# EAGLE design LM22674-5.0 (EAGLE 9.2.2)
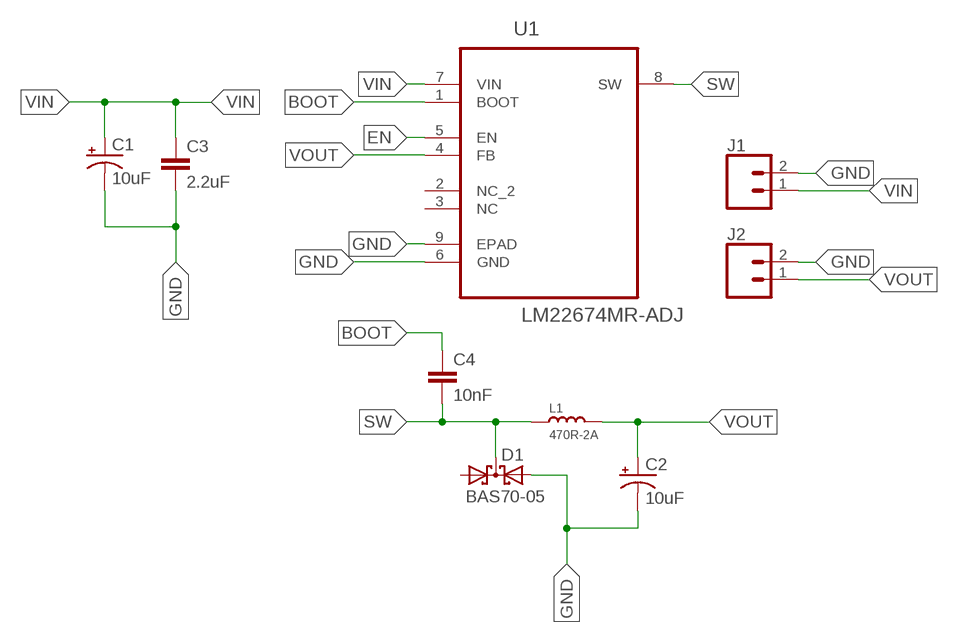
[diagram p0: schematic, sheet 1]

## Parts
C1  10uF  10UF-POLAR-EIA3216-16V-10%(TANT)  [EIA3216]
C2  10uF  10UF-POLAR-EIA3216-16V-10%(TANT)  [EIA3216]
C3  2.2uF  2.2UF-0603-10V-20%  [0603]
C4  10nF  10NF-0603-50V-10%  [0603]
D1  BAS70-05  [SOT23]
J1  CONN_02PTH4  [1X02_XTRA_BIG]
J2  CONN_02PTH4  [1X02_XTRA_BIG]
L1  470R-2A  SMD-FERRITE-BEAD-470R-2A(0805)'0805'  [L0805]
U1  LM22674MR-ADJ  [SOIC127P600X168-9N]

## Nets
BOOT: C4.1 U1.1(BOOT)
EN: U1.5(EN)
GND: C1.- C2.- C3.2 D1.2(A2) J1.2 J2.2 U1.6(GND) U1.9(EPAD)
SW: C4.2 D1.3(C) L1.1 U1.8(SW)
VIN: C1.+ C3.1 J1.1 U1.7(VIN)
VOUT: C2.+ J2.1 L1.2 U1.4(FB)
Unconnected: D1.1(A1) U1.2(NC_2) U1.3(NC)

## Library data of the parts
C1 C2 = SparkFun-Capacitors:10UF-POLAR: 10.0µF polarized capacitors A capacitor is a passive two-terminal electrical component used to store electrical energy temporarily in an electric field.; PROD_ID: CAP-00811
C3 = SparkFun-Capacitors:2.2UF: 2.2µF ceramic capacitors A capacitor is a passive two-terminal electrical component used to store electrical energy temporarily in an electric field.; PROD_ID: CAP-07888
C4 = SparkFun-Capacitors:10NF: 0.01uF/10nF/10,000pF ceramic capacitors A capacitor is a passive two-terminal electrical component used to store electrical energy temporarily in an electric field. CAP-09321; PROD_ID: CAP-00867
D1 = diode:BAS70-05: Silicon Schottky Diodes General-purpose diode for high-speed switching
J1 J2 = SparkFun-Connectors:CONN_02: Multi connection point. Often used as Generic Header-pin footprint for 0.1 inch spaced/style header connections On any of the 0.1 inch spaced packages, you can populate with these: Break Away Headers - Straight <https://www.sparkfun.com/products/116> (PRT-00116) Break Away Male Headers - Right Angle <https://www.sparkfun.com/products/553> (PRT-00553) Female Headers <https://www.sparkfun.com/products/115> (PRT-00115) Break Away Headers - Machine Pin <https://www.sparkfun.com/products/117> (PRT-00117) Break Away Female Headers - Swiss Machine Pin <https://www.sparkfun.com/products/743> (PRT-00743) For SCREWTERMINALS and SPRING TERMINALS visit here: Screw Terimnals on SparkFun.com <https://www.sparkfun.com/search/results?term=Screw+Terminals> (5mm/3.5mm/2.54mm spacing) This device is also useful as a general connection point to wire up your design to another part of your project. Our various solder wires solder well into these plated through hole pads. Hook-Up Wire - Assortment (Stranded, 22 AWG) <https://www.sparkfun.com/products/11375> (PRT-11375) Hook-Up Wire - Assortment (Solid Core, 22 AWG) <https://www.sparkfun.com/products/11367> (PRT-11367) View the entire wire category on our website here <https://www.sparkfun.com/categories/141> Special notes: Molex polarized connector foot print use with: PRT-08233 with associated crimp pins and housings. 2.54_SCREWTERM for use with PRT-10571. 3.5mm Screw Terminal footprints for PRT-08084 5mm Screw Terminal footprints for use with PRT-08432
L1 = Seeed-Inductor:SMD-FERRITE-BEAD-470R-2A(0805): 303030008; MPN: WLB2012-471T20
U1 = LM22674MR-ADJ:LM22674MR-ADJ: Step-Down Voltage Regulator; AVAILABILITY: Unavailable; DESCRIPTION: REGULATOR, ADJ. VOLTAGE, 0.5A 8PSOP; Primary Input Voltage: 42V; No. of Outputs: 1; Output Current: 500mA; Voltage Re...; MF: Texas Instruments; MP: LM22674MR-ADJ; PACKAGE: None; PRICE: None

## Board
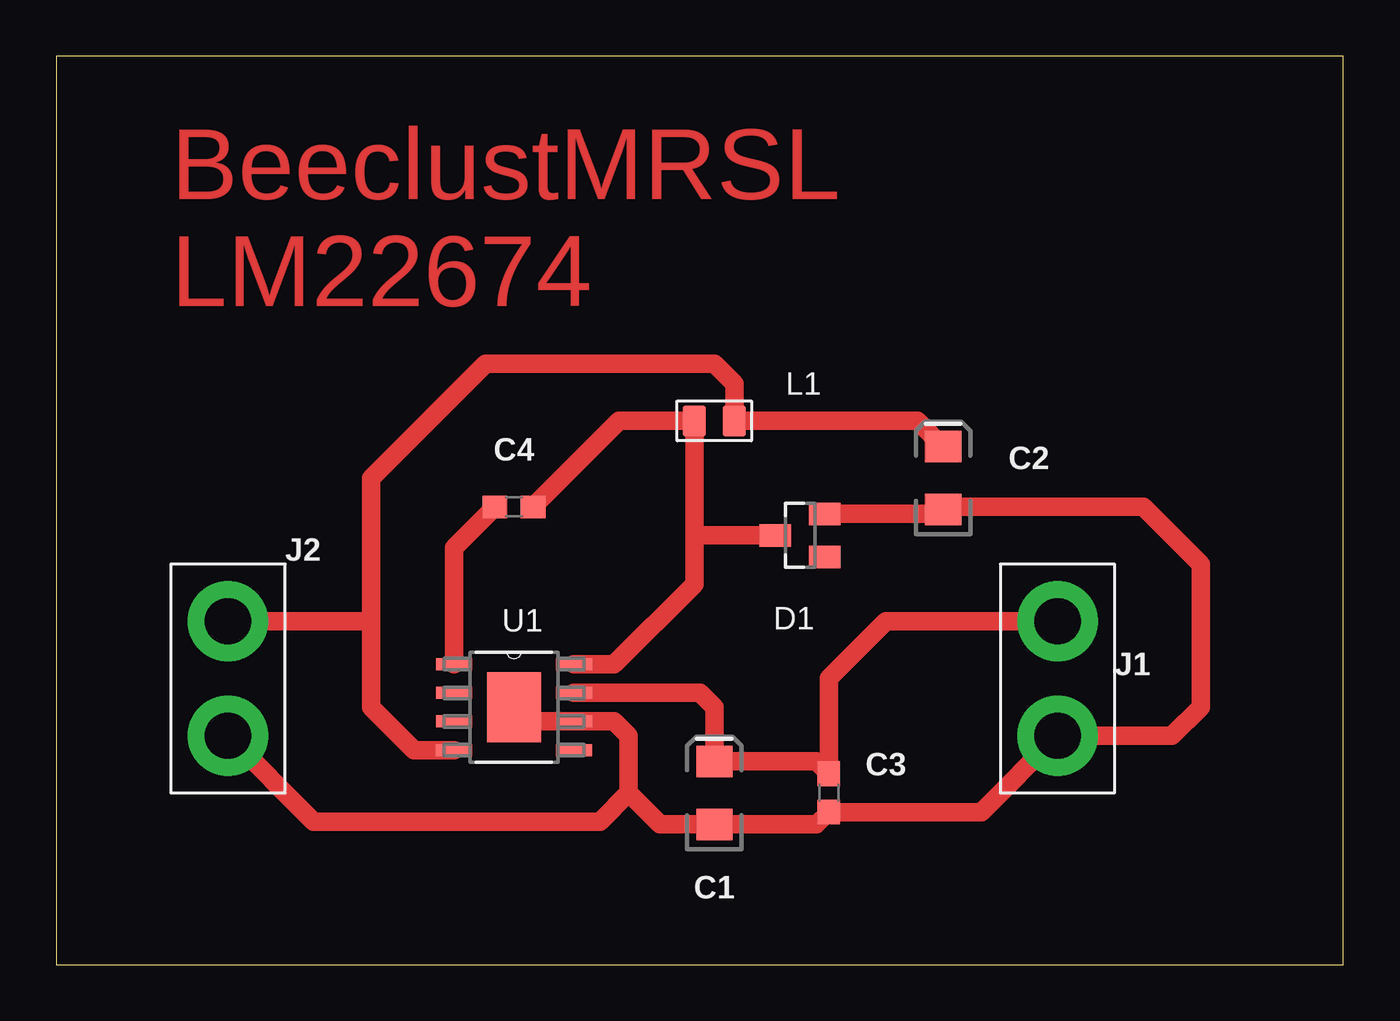
[diagram p1: board, top side]

Size 57.13 x 40.31 mm. Coordinates in mm from the lower left corner, seen from the top.
Outline: 0,0 57.13,0 57.13,40.31 0,40.31 0,0
Copper layers (1*16): Top 0.035mm / dielectric 1.5mm / Bottom 0.035mm
Design rules "default": minimum track width 6mil, minimum drill 0.35mm, track to track 6mil, track to pad 6mil, pad to pad 6mil, via to via 6mil, smd to smd 6mil, copper to edge 40mil, drill to drill 6mil, minimum pad ring 10mil, minimum via ring 8mil, stop-mask expansion 4mil, vias tented up to drill 0mil, thermal gap 10mil

### Footprints (pad centres in the part's own frame; a part is rotated, then mirrored left to right if it is on the bottom)
EIA3216 = smd 1.4 x 1.6: + 1.4,0; - -1.4,0
0603 = smd 1.1 x 1: 1 -0.85,0; 2 0.85,0
SOT23 = smd 1 x 1.4: 1 -0.95,-1.1; 2 0.95,-1.1; 3 0,1.1
1X02_XTRA_BIG = drill 2.057 pad 3.556: 1 -2.54,0; 2 2.54,0
L0805 = smd 1.016 x 1.397: 1 -0.889,0; 2 0.889,0
SOIC127P600X168-9N = smd 1.6 x 0.533: 1 -2.667,1.905; 2 -2.667,0.635; 3 -2.667,-0.635; 4 -2.667,-1.905; 5 2.667,-1.905; 6 2.667,-0.635; 7 2.667,0.635; 8 2.667,1.905 | smd 2.413 x 3.099: 9 0,0

### Placement (x,y rotation side)
C1  29.21,7.62 90 top
C2  39.37,21.59 90 top
C3  34.29,7.62 270 top
C4  20.32,20.32 0 top
D1  33.02,19.05 90 top
J1  44.45,12.7 270 top
J2  7.62,12.7 270 top
L1  29.21,24.13 0 top
U1  20.32,11.43 0 top

### Tracks (layer width: path | path; a pad name or v marks a point on that pad's centre or on a via)
BOOT
  Top 0.813: U1.1 17.65,18.5 C4.1
GND
  Top 0.813: U1.9 20.95,10.79 U1.6 24.77,10.79 25.4,10.16 25.4,7.62 | 25.4,7.62 26.8,6.22 C1.- 33.74,6.22 C3.2 41.06,6.77 J1.2 49.53,10.16 50.8,11.43 50.8,17.78 48.26,20.32 39.5,20.32 C2.- 39.18,20 D1.2 | 25.4,7.62 24.13,6.35 11.43,6.35 J2.2
SW
  Top 0.813: C4.2 24.98,24.13 L1.1 28.32,19.05 | U1.8 24.77,13.34 28.32,16.89 28.32,19.05 | D1.3 28.32,19.05
VIN
  Top 0.813: U1.7 28.57,12.06 29.21,11.43 C1.+ | C1.+ 29.34,8.89 | C1.+ 33.74,9.02 C3.1 34.29,12.7 36.83,15.24 J1.1
VOUT
  Top 0.813: U1.4 15.88,9.53 13.97,11.43 13.97,15.24 | 13.97,15.24 13.97,21.59 19.05,26.67 29.21,26.67 30.1,25.78 L1.2 38.23,24.13 C2.+ | J2.1 13.97,15.24

### Text on the board
Top: BeeclustMRSL / LM22674